# EAGLE design motor (EAGLE 6.3)
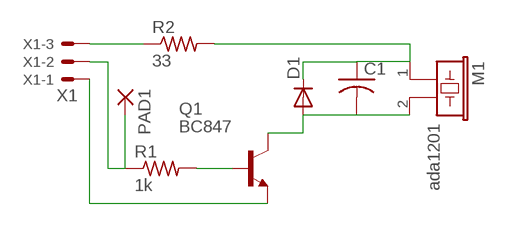
[diagram p0: schematic, sheet 1]

## Parts
C1  C-USC0603  [C0603]
D1  DIODE-DO214AC  [DO214AC]
M1  ada1201  B/C11L  [B/C11L]
PAD1  1,6/0,8  [1,6/0,8]
Q1  BC847  BCX70SMD  [SOT23]
R1  1k  R-US_R0805  [R0805]
R2  33  R-US_R0805  [R0805]
X1  X1  22-23-2031  [22-23-2031]

## Nets
5V: R2.1 X1.3
GND: Q1.2(E) X1.1
N$1: PAD1.1(P) R1.1 X1.2
N$2: Q1.1(B) R1.2
N$3: C1.2 D1.A M1.2 Q1.3(C)
N$4: C1.1 D1.C M1.1 R2.2

## Library data of the parts
C1 = resistor:C-US: CAPACITOR, American symbol
D1 = diode:DIODE-: DIODE
M1 = buzzer:B/C11L: BUZZER Source: Buerklin; OC_FARNELL: unknown; OC_NEWARK: unknown
PAD1 = wirepad:1,6/0,8: THROUGH-HOLE PAD
Q1 = transistor-npn:BCX70*: NPN Transistor
R1 R2 = resistor:R-US_: RESISTOR, American symbol
X1 = con-molex:22-23-2031: .100" (2.54mm) Center Header - 3 Pin; MF: MOLEX; MPN: 22-23-2031; OC_FARNELL: 1462950; OC_NEWARK: 30C0862

## Net classes
0 default: width 0.508 mm

## Board
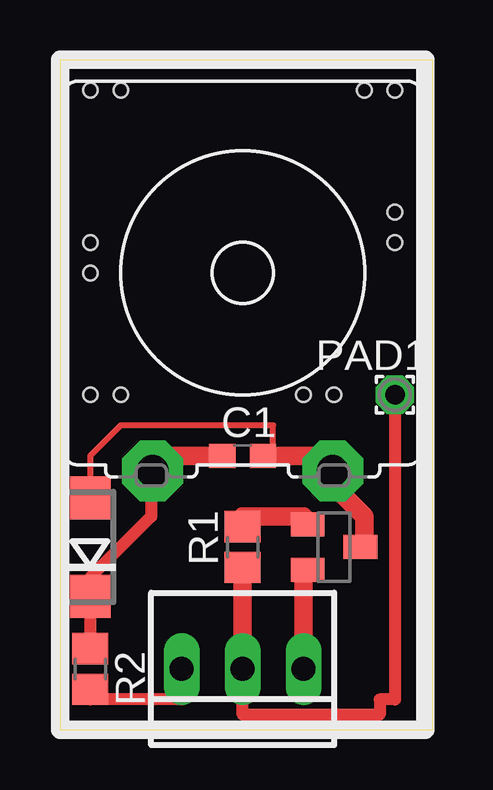
[diagram p1: board, top side]

Size 15.54 x 27.93 mm. Coordinates in mm from the lower left corner, seen from the top.
Outline: 0,0 15.54,0 15.54,27.93 0,27.93 0,0
Copper layers (1*16): Top 0.035mm / dielectric 1.5mm / Bottom 0.035mm
Design rules "default": minimum track width 10mil, minimum drill 24mil, track to track 8mil, track to pad 8mil, pad to pad 8mil, via to via 8mil, smd to smd 8mil, copper to edge 40mil, drill to drill 8mil, minimum pad ring 10mil, minimum via ring 8mil, stop-mask expansion 4mil, vias tented up to drill 0mil, thermal gap 10mil
Holes 0.6 mm at 1.27,26.67 13.97,26.67 1.27,13.97 11.43,13.97 2.54,13.97 2.54,26.67 12.7,26.67 10.16,13.97 1.27,20.32 1.27,19.05 13.97,21.59 13.97,20.32

### Footprints (pad centres in the part's own frame; a part is rotated, then mirrored left to right if it is on the bottom)
C0603 = smd 1.1 x 1: 1 -0.85,0; 2 0.85,0
DO214AC = smd 1.8 x 1.7: A 2.05,0; C -2.05,0
B/C11L = drill 1.321 pad 2.54 octagon: 1 -3.759,-8.255; 2 3.759,-8.255
1,6/0,8 = drill 0.813 pad 1.6 octagon: 1 0,0
SOT23 = smd 1 x 1.4: 1 -0.95,-1.1; 2 0.95,-1.1; 3 0,1.1
R0805 = smd 1.3 x 1.5: 1 -0.85,0; 2 0.85,0
22-23-2031 = drill 1 long: 1 -2.54,0; 2 0,0; 3 2.54,0

### Placement (x,y rotation side)
C1  7.62,11.43 0 top
D1  1.27,7.62 90 top
M1  7.62,19.05 0 top
PAD1  13.97,13.97 0 top
Q1  11.43,7.62 270 top
R1  7.62,7.62 90 top
R2  1.27,2.54 90 top
X1  7.62,2.54 180 top

### Tracks (layer width: path | path; a pad name or v marks a point on that pad's centre or on a via)
5V
  Top 0.508: X1.3 5.08,1.27 1.27,1.27 R2.1
GND
  Top 0.762: X1.1 10.16,6.35 Q1.2
N$1
  Top 0.508: PAD1.1 13.97,1.27 13.34,1.27 13.34,0.64 7.62,0.64 X1.2
  Top 0.762: X1.2 R1.1
N$2
  Top 0.762: Q1.1 10.16,8.89 7.62,8.89 R1.2
N$3
  Top 0.254: D1.A 1.27,11.43 2.54,12.7 8.89,12.7 8.89,11.43
  Top 0.762: C1.2 8.89,11.43 11.43,11.43 M1.2 11.43,10.16 12.7,8.89 12.7,7.62 Q1.3
N$4
  Top 0.508: R2.2 D1.C 1.27,6.35 3.81,8.89 3.81,10.16 M1.1
  Top 0.762: C1.1 3.81,11.43 M1.1